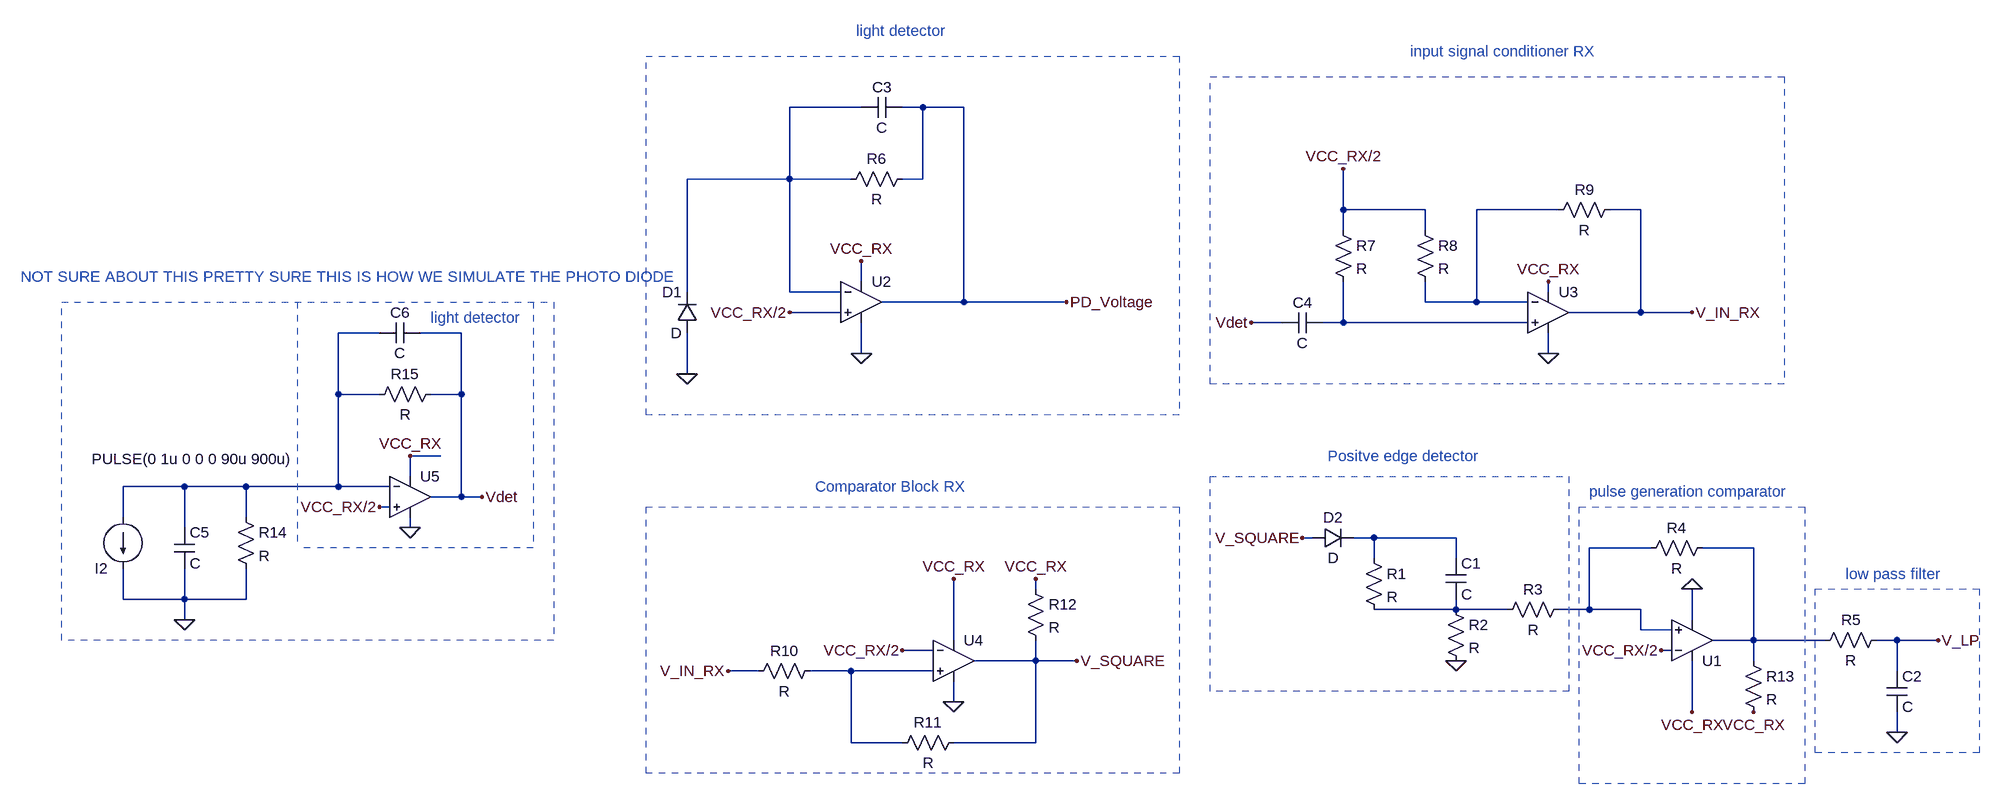
[diagram p0: schematic RX Ryder draft.asc]
RX Ryder draft.asc, the LTspice schematic file:
Version 4.1
SHEET 1 1724 680
WIRE -32 -720 -144 -720
WIRE 64 -720 32 -720
WIRE 128 -720 64 -720
WIRE -144 -608 -144 -720
WIRE -144 -608 -304 -608
WIRE -48 -608 -144 -608
WIRE 64 -608 64 -720
WIRE 64 -608 32 -608
WIRE 720 -560 720 -624
WIRE 848 -560 720 -560
WIRE 1056 -560 928 -560
WIRE 1184 -560 1136 -560
WIRE 720 -528 720 -560
WIRE 848 -528 848 -560
WIRE -32 -448 -32 -480
WIRE -304 -432 -304 -608
WIRE -144 -432 -144 -608
WIRE -64 -432 -144 -432
WIRE 1040 -432 1040 -448
WIRE 128 -416 128 -720
WIRE 128 -416 0 -416
WIRE 288 -416 128 -416
WIRE 848 -416 848 -448
WIRE 928 -416 928 -560
WIRE 928 -416 848 -416
WIRE 1008 -416 928 -416
WIRE -64 -400 -144 -400
WIRE 1184 -400 1184 -560
WIRE 1184 -400 1072 -400
WIRE 1264 -400 1184 -400
WIRE 624 -384 576 -384
WIRE 720 -384 720 -448
WIRE 720 -384 688 -384
WIRE 1008 -384 720 -384
WIRE -784 -368 -848 -368
WIRE -656 -368 -720 -368
WIRE -32 -336 -32 -384
WIRE 1040 -336 1040 -368
WIRE -304 -304 -304 -368
WIRE -848 -272 -848 -368
WIRE -784 -272 -848 -272
WIRE -656 -272 -656 -368
WIRE -656 -272 -704 -272
WIRE -688 -176 -736 -176
WIRE -736 -144 -736 -176
WIRE -1088 -128 -1184 -128
WIRE -992 -128 -1088 -128
WIRE -848 -128 -848 -272
WIRE -848 -128 -992 -128
WIRE -768 -128 -848 -128
WIRE -656 -112 -656 -272
WIRE -656 -112 -704 -112
WIRE -624 -112 -656 -112
WIRE -768 -96 -784 -96
WIRE -1184 -80 -1184 -128
WIRE -992 -80 -992 -128
WIRE -1088 -64 -1088 -128
WIRE -736 -64 -736 -80
WIRE 672 -48 656 -48
WIRE 768 -48 736 -48
WIRE 896 -48 768 -48
WIRE 1200 -32 1104 -32
WIRE 1360 -32 1280 -32
WIRE 768 -16 768 -48
WIRE 896 -16 896 -48
WIRE 240 32 240 16
WIRE -1184 48 -1184 0
WIRE -1088 48 -1088 0
WIRE -1088 48 -1184 48
WIRE -992 48 -992 0
WIRE -992 48 -1088 48
WIRE 896 64 896 48
WIRE 896 64 768 64
WIRE 976 64 896 64
WIRE 1104 64 1104 -32
WIRE 1104 64 1056 64
WIRE 1184 64 1104 64
WIRE -1088 80 -1088 48
WIRE 1264 80 1264 32
WIRE 1184 96 1184 64
WIRE 1232 96 1184 96
WIRE 112 112 112 16
WIRE 1360 112 1360 -32
WIRE 1360 112 1296 112
WIRE 1472 112 1360 112
WIRE 1584 112 1552 112
WIRE 1648 112 1584 112
WIRE 80 128 32 128
WIRE 1232 128 1216 128
WIRE 240 144 240 112
WIRE 240 144 144 144
WIRE 304 144 240 144
WIRE 1360 144 1360 112
WIRE -192 160 -240 160
WIRE -48 160 -112 160
WIRE 80 160 -48 160
WIRE 1584 160 1584 112
WIRE 112 208 112 176
WIRE 1264 224 1264 144
WIRE 1584 256 1584 224
WIRE -48 272 -48 160
WIRE 32 272 -48 272
WIRE 240 272 240 144
WIRE 240 272 112 272
FLAG 896 144 0
FLAG 1264 32 0
FLAG 1584 256 0
FLAG -304 -304 0
FLAG -32 -336 0
FLAG -32 -480 VCC_RX
FLAG -144 -400 VCC_RX/2
FLAG 288 -416 PD_Voltage
FLAG 1040 -336 0
FLAG 1040 -448 VCC_RX
FLAG 720 -624 VCC_RX/2
FLAG 1264 -400 V_IN_RX
FLAG -240 160 V_IN_RX
FLAG 304 144 V_SQUARE
FLAG 240 16 VCC_RX
FLAG 112 208 0
FLAG 112 16 VCC_RX
FLAG 32 128 VCC_RX/2
FLAG 656 -48 V_SQUARE
FLAG 1264 224 VCC_RX
FLAG 1216 128 VCC_RX/2
FLAG 1648 112 V_LP
FLAG 1360 224 VCC_RX
FLAG -1088 80 0
FLAG -736 -64 0
FLAG -736 -176 VCC_RX
FLAG -624 -112 Vdet
FLAG -784 -96 VCC_RX/2
FLAG 576 -384 Vdet
SYMBOL diode 672 -32 R270
WINDOW 0 32 32 VTop 2
WINDOW 3 0 32 VBottom 2
SYMATTR InstName D2
SYMBOL res 752 -32 R0
SYMATTR InstName R1
SYMBOL cap 880 -16 R0
SYMATTR InstName C1
SYMBOL res 880 48 R0
SYMATTR InstName R2
SYMBOL res 1072 48 R90
WINDOW 0 0 56 VBottom 2
WINDOW 3 32 56 VTop 2
SYMATTR InstName R3
SYMBOL res 1296 -48 R90
WINDOW 0 0 56 VBottom 2
WINDOW 3 32 56 VTop 2
SYMATTR InstName R4
SYMBOL OpAmps\\UniversalOpAmp 1264 112 M180
SYMATTR InstName U1
SYMBOL res 1568 96 R90
WINDOW 0 0 56 VBottom 2
WINDOW 3 32 56 VTop 2
SYMATTR InstName R5
SYMBOL cap 1568 160 R0
SYMATTR InstName C2
SYMBOL diode -288 -368 R180
WINDOW 0 24 64 Left 2
WINDOW 3 24 0 Left 2
SYMATTR InstName D1
SYMBOL cap 32 -736 R90
WINDOW 0 0 32 VBottom 2
WINDOW 3 32 32 VTop 2
SYMATTR InstName C3
SYMBOL res 48 -624 R90
WINDOW 0 0 56 VBottom 2
WINDOW 3 32 56 VTop 2
SYMATTR InstName R6
SYMBOL OpAmps\\UniversalOpAmp -32 -416 R0
SYMATTR InstName U2
SYMBOL res 704 -544 R0
SYMATTR InstName R7
SYMBOL res 832 -544 R0
SYMATTR InstName R8
SYMBOL res 1152 -576 R90
WINDOW 0 0 56 VBottom 2
WINDOW 3 32 56 VTop 2
SYMATTR InstName R9
SYMBOL OpAmps\\UniversalOpAmp 1040 -400 R0
SYMATTR InstName U3
SYMBOL cap 688 -400 R90
WINDOW 0 0 32 VBottom 2
WINDOW 3 32 32 VTop 2
SYMATTR InstName C4
SYMBOL res -96 144 R90
WINDOW 0 0 56 VBottom 2
WINDOW 3 32 56 VTop 2
SYMATTR InstName R10
SYMBOL res 128 256 R90
WINDOW 0 0 56 VBottom 2
WINDOW 3 32 56 VTop 2
SYMATTR InstName R11
SYMBOL res 224 16 R0
SYMATTR InstName R12
SYMBOL OpAmps\\UniversalOpAmp 112 144 R0
SYMATTR InstName U4
SYMBOL res 1344 128 R0
SYMATTR InstName R13
SYMBOL cap -1104 -64 R0
SYMATTR InstName C5
SYMBOL res -1008 -96 R0
SYMATTR InstName R14
SYMBOL res -688 -288 R90
WINDOW 0 0 56 VBottom 2
WINDOW 3 32 56 VTop 2
SYMATTR InstName R15
SYMBOL cap -720 -384 R90
WINDOW 0 0 32 VBottom 2
WINDOW 3 32 32 VTop 2
SYMATTR InstName C6
SYMBOL OpAmps\\UniversalOpAmp -736 -112 R0
SYMATTR InstName U5
SYMBOL current -1184 -80 M0
WINDOW 0 24 80 Left 2
WINDOW 3 -262 -91 Left 2
WINDOW 123 0 0 Left 0
WINDOW 39 0 0 Left 0
SYMATTR InstName I2
SYMATTR Value PULSE(0 1u 0 0 0 90u 900u)
TEXT 1504 8 Left 2 ;low pass filter
TEXT 1104 -120 Left 2 ;pulse generation comparator
TEXT 696 -176 Left 2 ;Positve edge detector
TEXT -40 -840 Left 2 ;light detector
TEXT 824 -808 Left 2 ;input signal conditioner RX
TEXT -104 -128 Left 2 ;Comparator Block RX
TEXT -1344 -456 Left 2 ;NOT SURE ABOUT THIS PRETTY SURE THIS IS HOW WE SIMULATE THE PHOTO DIODE
TEXT -704 -392 Left 2 ;light detector
LINE Normal 1456 288 1456 32 2
LINE Normal 1712 288 1456 288 2
LINE Normal 1712 32 1712 288 2
LINE Normal 1456 32 1712 32 2
LINE Normal 1088 336 1088 -96 2
LINE Normal 1440 336 1088 336 2
LINE Normal 1440 -96 1440 336 2
LINE Normal 1088 -96 1440 -96 2
LINE Normal 512 192 512 -144 2
LINE Normal 1072 192 512 192 2
LINE Normal 1072 -144 1072 192 2
LINE Normal 512 -144 1072 -144 2
LINE Normal -368 -240 -368 -800 2
LINE Normal 464 -240 -368 -240 2
LINE Normal 464 -800 464 -240 2
LINE Normal -368 -800 464 -800 2
LINE Normal 512 -288 512 -768 2
LINE Normal 1408 -288 512 -288 2
LINE Normal 1408 -768 1408 -288 2
LINE Normal 512 -768 1408 -768 2
LINE Normal -368 320 -368 -96 2
LINE Normal 464 320 -368 320 2
LINE Normal 464 -96 464 320 2
LINE Normal -368 -96 464 -96 2
LINE Normal -1280 112 -1280 -416 2
LINE Normal -512 112 -1280 112 2
LINE Normal -512 -416 -512 112 2
LINE Normal -544 -32 -912 -32 2
LINE Normal -1280 -416 -512 -416 2
LINE Normal -544 -416 -544 -32 2
LINE Normal -912 -416 -912 -32 2

The netlist it stands for:
* RX Ryder draft.asc
D2 V_SQUARE N005 D
R1 N005 N008 R
C1 N005 N008 C
R2 N008 0 R
R3 N006 N008 R
R4 N007 N006 R
X§U1 N006 VCC_RX/2 VCC_RX 0 N007 level1 Avol=1Meg GBW=10Meg Vos=0 En=0 Enk=0 In=0 Ink=0 Rin=500Meg  ; pins In+ In- V+ V- OUT
R5 V_LP N007 R
C2 V_LP 0 C
D1 0 N001 D
C3 PD_Voltage N001 C
R6 PD_Voltage N001 R
X§U2 VCC_RX/2 N001 VCC_RX 0 PD_Voltage level1 Avol=1Meg GBW=10Meg Vos=0 En=0 Enk=0 In=0 Ink=0 Rin=500Meg  ; pins In+ In- V+ V- OUT
R7 VCC_RX/2 N003 R
R8 VCC_RX/2 N002 R
R9 V_IN_RX N002 R
X§U3 N003 N002 VCC_RX 0 V_IN_RX level1 Avol=1Meg GBW=10Meg Vos=0 En=0 Enk=0 In=0 Ink=0 Rin=500Meg  ; pins In+ In- V+ V- OUT
C4 N003 Vdet C
R10 N009 V_IN_RX R
R11 V_SQUARE N009 R
R12 VCC_RX V_SQUARE R
X§U4 N009 VCC_RX/2 VCC_RX 0 V_SQUARE level1 Avol=1Meg GBW=10Meg Vos=0 En=0 Enk=0 In=0 Ink=0 Rin=500Meg  ; pins In+ In- V+ V- OUT
R13 N007 VCC_RX R
C5 N004 0 C
R14 N004 0 R
R15 Vdet N004 R
C6 Vdet N004 C
X§U5 VCC_RX/2 N004 VCC_RX 0 Vdet level1 Avol=1Meg GBW=10Meg Vos=0 En=0 Enk=0 In=0 Ink=0 Rin=500Meg  ; pins In+ In- V+ V- OUT
I2 N004 0 PULSE(0 1u 0 0 0 90u 900u)
.model D D
.lib standard.dio
* low pass filter
* pulse generation comparator
* Positve edge detector
* light detector
* input signal conditioner RX
* Comparator Block RX
* NOT SURE ABOUT THIS PRETTY SURE THIS IS HOW WE SIMULATE THE PHOTO DIODE
* light detector
.lib UniversalOpAmp1.lib
.backanno
.end